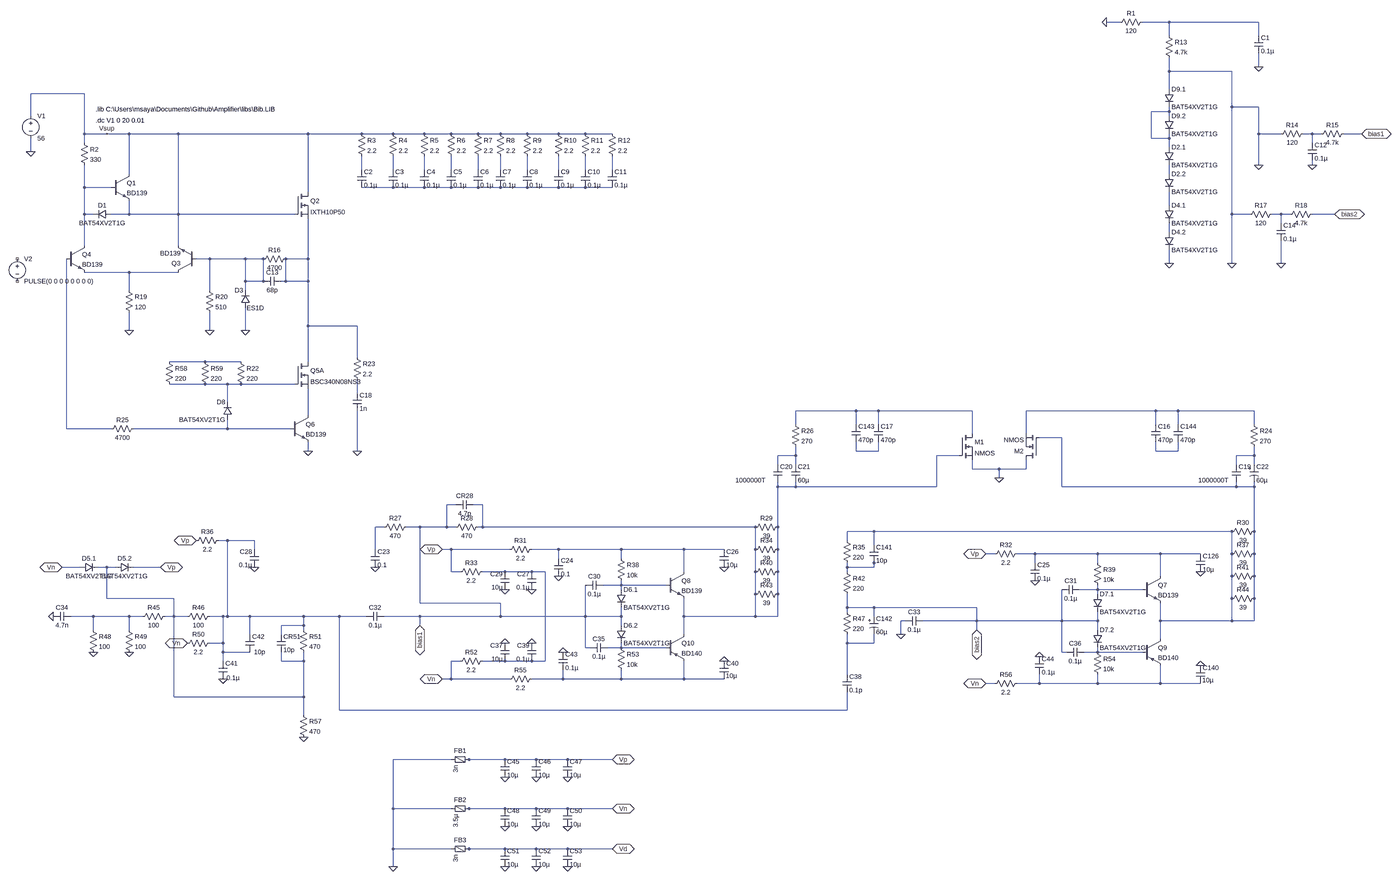
[diagram p0: schematic pulse Amplifier.asc, whole sheet]
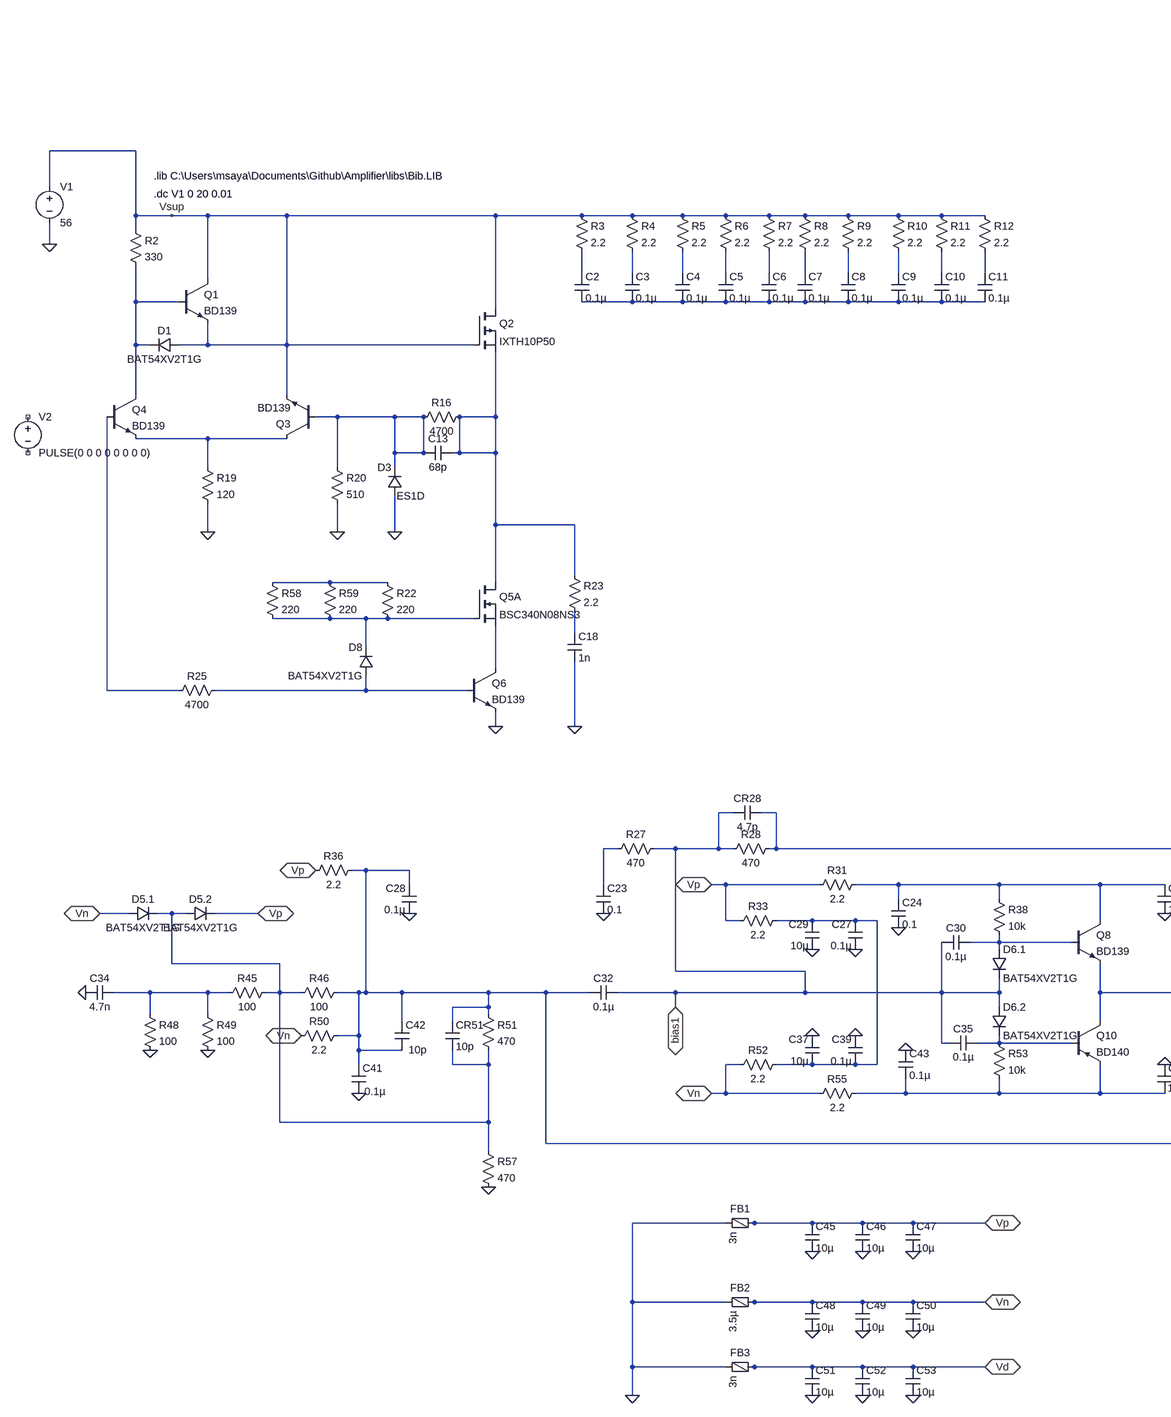
[diagram p1: schematic pulse Amplifier.asc, part, row 1 of 1, column 1 of 2]
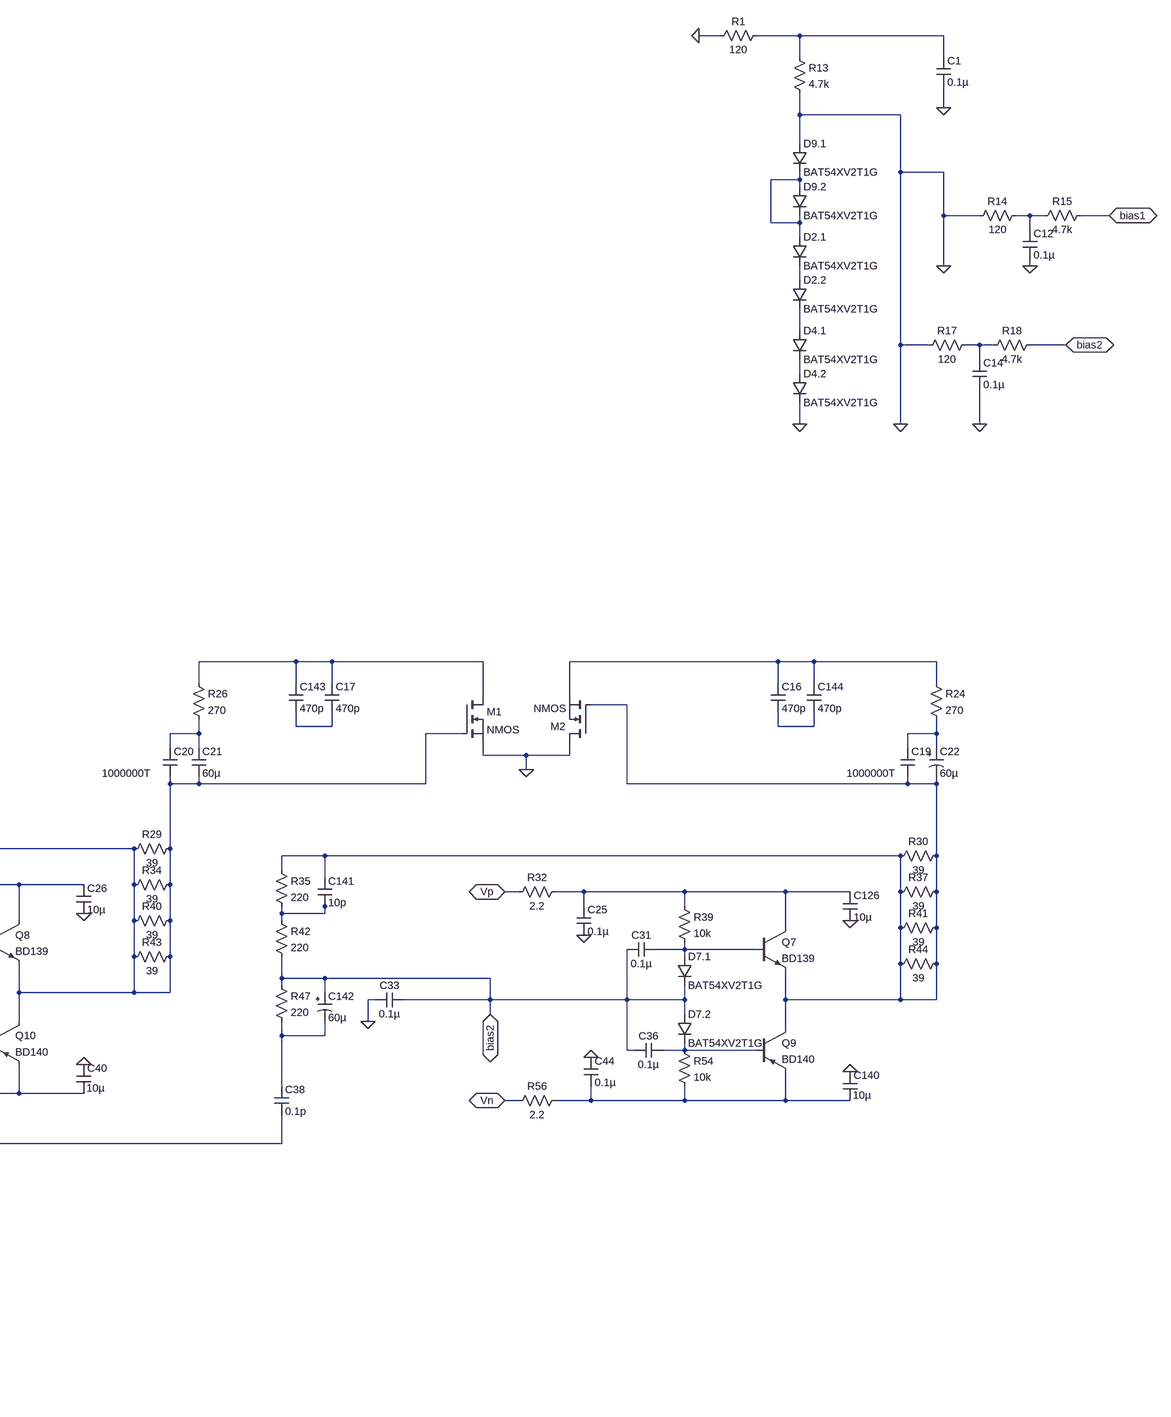
[diagram p2: schematic pulse Amplifier.asc, part, row 1 of 1, column 2 of 2]
pulse Amplifier.asc, the LTspice schematic file:
Version 4
SHEET 1 4920 2452
WIRE 3936 -672 3888 -672
WIRE 4112 -672 4016 -672
WIRE 4432 -672 4112 -672
WIRE 4112 -624 4112 -672
WIRE 4432 -624 4432 -672
WIRE 4432 -512 4432 -560
WIRE 4112 -496 4112 -544
WIRE 4336 -496 4112 -496
WIRE 4112 -432 4112 -496
WIRE 192 -416 0 -416
WIRE 4336 -368 4336 -496
WIRE 4432 -368 4336 -368
WIRE 4112 -352 4112 -368
WIRE 4112 -352 4048 -352
WIRE 0 -336 0 -416
WIRE 4112 -336 4112 -352
WIRE 192 -272 192 -416
WIRE 272 -272 192 -272
WIRE 352 -272 272 -272
WIRE 528 -272 352 -272
WIRE 992 -272 528 -272
WIRE 1184 -272 992 -272
WIRE 1296 -272 1184 -272
WIRE 1408 -272 1296 -272
WIRE 1504 -272 1408 -272
WIRE 1600 -272 1504 -272
WIRE 1680 -272 1600 -272
WIRE 1776 -272 1680 -272
WIRE 1888 -272 1776 -272
WIRE 1984 -272 1888 -272
WIRE 2080 -272 1984 -272
WIRE 4432 -272 4432 -368
WIRE 4512 -272 4432 -272
WIRE 4624 -272 4592 -272
WIRE 4656 -272 4624 -272
WIRE 4800 -272 4736 -272
WIRE 4048 -256 4048 -352
WIRE 4112 -256 4112 -272
WIRE 4112 -256 4048 -256
WIRE 192 -240 192 -272
WIRE 4624 -240 4624 -272
WIRE 4112 -224 4112 -256
WIRE 0 -208 0 -256
WIRE 4432 -160 4432 -272
WIRE 4624 -160 4624 -176
WIRE 1184 -144 1184 -192
WIRE 1296 -144 1296 -192
WIRE 1408 -144 1408 -192
WIRE 1504 -144 1504 -192
WIRE 1600 -144 1600 -192
WIRE 1680 -144 1680 -192
WIRE 1776 -144 1776 -192
WIRE 1888 -144 1888 -192
WIRE 1984 -144 1984 -192
WIRE 2080 -144 2080 -192
WIRE 352 -128 352 -272
WIRE 4112 -128 4112 -160
WIRE 192 -80 192 -160
WIRE 288 -80 192 -80
WIRE 1296 -80 1184 -80
WIRE 1408 -80 1296 -80
WIRE 1504 -80 1408 -80
WIRE 1600 -80 1504 -80
WIRE 1680 -80 1600 -80
WIRE 1776 -80 1680 -80
WIRE 1888 -80 1776 -80
WIRE 1984 -80 1888 -80
WIRE 2080 -80 1984 -80
WIRE 992 -64 992 -272
WIRE 4112 -16 4112 -64
WIRE 192 16 192 -80
WIRE 224 16 192 16
WIRE 352 16 352 -32
WIRE 352 16 288 16
WIRE 528 16 528 -272
WIRE 528 16 352 16
WIRE 944 16 528 16
WIRE 4336 16 4336 -368
WIRE 4400 16 4336 16
WIRE 4512 16 4480 16
WIRE 4544 16 4512 16
WIRE 4704 16 4624 16
WIRE 4512 48 4512 16
WIRE 4112 80 4112 48
WIRE 192 128 192 16
WIRE 528 128 528 16
WIRE 640 176 592 176
WIRE 768 176 640 176
WIRE 832 176 768 176
WIRE 992 176 992 32
WIRE 992 176 912 176
WIRE 4112 192 4112 144
WIRE 4336 192 4336 16
WIRE 4512 192 4512 112
WIRE 352 224 192 224
WIRE 528 224 352 224
WIRE 768 256 768 176
WIRE 832 256 832 176
WIRE 832 256 768 256
WIRE 912 256 912 176
WIRE 912 256 896 256
WIRE 992 256 992 176
WIRE 992 256 912 256
WIRE 352 288 352 224
WIRE 640 288 640 176
WIRE 768 288 768 256
WIRE 992 416 992 256
WIRE 1168 416 992 416
WIRE 352 432 352 368
WIRE 640 432 640 368
WIRE 768 432 768 352
WIRE 1168 528 1168 416
WIRE 624 544 496 544
WIRE 752 544 624 544
WIRE 992 544 992 416
WIRE 624 624 496 624
WIRE 704 624 624 624
WIRE 752 624 704 624
WIRE 944 624 752 624
WIRE 1168 656 1168 608
WIRE 704 688 704 624
WIRE 2992 720 2736 720
WIRE 3072 720 2992 720
WIRE 3408 720 3072 720
WIRE 4064 720 3600 720
WIRE 4144 720 4064 720
WIRE 4416 720 4144 720
WIRE 992 736 992 640
WIRE 2736 768 2736 720
WIRE 2992 768 2992 720
WIRE 3072 768 3072 720
WIRE 4064 768 4064 720
WIRE 4144 768 4144 720
WIRE 4416 768 4416 720
WIRE 128 784 128 176
WIRE 288 784 128 784
WIRE 704 784 704 752
WIRE 704 784 368 784
WIRE 928 784 704 784
WIRE 3408 800 3408 720
WIRE 3600 800 3600 720
WIRE 3728 816 3648 816
WIRE 992 864 992 832
WIRE 1168 864 1168 720
WIRE 2992 864 2992 832
WIRE 3072 864 3072 832
WIRE 3072 864 2992 864
WIRE 4064 864 4064 832
WIRE 4144 864 4144 832
WIRE 4144 864 4064 864
WIRE 2736 880 2736 848
WIRE 2736 880 2672 880
WIRE 3360 880 3280 880
WIRE 4416 880 4416 848
WIRE 4416 880 4352 880
WIRE 2672 912 2672 880
WIRE 2736 912 2736 880
WIRE 4352 912 4352 880
WIRE 4416 912 4416 880
WIRE 3408 928 3408 896
WIRE 3504 928 3408 928
WIRE 3600 928 3600 896
WIRE 3600 928 3504 928
WIRE 3504 960 3504 928
WIRE 2672 992 2672 976
WIRE 2736 992 2736 976
WIRE 2736 992 2672 992
WIRE 3280 992 3280 880
WIRE 3280 992 2736 992
WIRE 3728 992 3728 816
WIRE 4352 992 4352 976
WIRE 4352 992 3728 992
WIRE 4416 992 4416 976
WIRE 4416 992 4352 992
WIRE 1520 1056 1488 1056
WIRE 1616 1056 1584 1056
WIRE 1264 1136 1232 1136
WIRE 1392 1136 1344 1136
WIRE 1488 1136 1488 1056
WIRE 1488 1136 1392 1136
WIRE 1520 1136 1488 1136
WIRE 1616 1136 1616 1056
WIRE 1616 1136 1600 1136
WIRE 2592 1136 1616 1136
WIRE 2672 1136 2672 992
WIRE 3056 1152 2960 1152
WIRE 4336 1152 3056 1152
WIRE 4416 1152 4416 992
WIRE 704 1184 672 1184
WIRE 800 1184 704 1184
WIRE 2960 1184 2960 1152
WIRE 3056 1200 3056 1152
WIRE 800 1216 800 1184
WIRE 1232 1216 1232 1136
WIRE 1504 1216 1472 1216
WIRE 1712 1216 1504 1216
WIRE 1888 1216 1792 1216
WIRE 2112 1216 1888 1216
WIRE 2336 1216 2112 1216
WIRE 2480 1216 2336 1216
WIRE 2592 1216 2592 1136
WIRE 2672 1216 2672 1136
WIRE 3488 1232 3456 1232
WIRE 3632 1232 3568 1232
WIRE 3856 1232 3632 1232
WIRE 4080 1232 3856 1232
WIRE 4224 1232 4080 1232
WIRE 4336 1232 4336 1152
WIRE 4416 1232 4416 1152
WIRE 1888 1248 1888 1216
WIRE 2112 1248 2112 1216
WIRE 3056 1264 3056 1248
WIRE 3632 1264 3632 1232
WIRE 3856 1264 3856 1232
WIRE 176 1280 112 1280
WIRE 272 1280 240 1280
WIRE 304 1280 272 1280
WIRE 464 1280 368 1280
WIRE 2960 1280 2960 1264
WIRE 3056 1280 3056 1264
WIRE 3056 1280 2960 1280
WIRE 1504 1296 1504 1216
WIRE 1536 1296 1504 1296
WIRE 1696 1296 1616 1296
WIRE 1792 1296 1696 1296
WIRE 1840 1296 1792 1296
WIRE 2336 1296 2336 1216
WIRE 2592 1296 2592 1216
WIRE 2672 1296 2672 1216
WIRE 2960 1296 2960 1280
WIRE 4080 1312 4080 1232
WIRE 4336 1312 4336 1232
WIRE 4416 1312 4416 1232
WIRE 2112 1344 2112 1328
WIRE 2112 1344 2048 1344
WIRE 2272 1344 2112 1344
WIRE 2112 1360 2112 1344
WIRE 3856 1360 3856 1344
WIRE 3856 1360 3792 1360
WIRE 4016 1360 3856 1360
WIRE 2592 1376 2592 1296
WIRE 2672 1376 2672 1296
WIRE 3856 1376 3856 1360
WIRE 272 1392 272 1280
WIRE 512 1392 272 1392
WIRE 4336 1392 4336 1312
WIRE 4416 1392 4416 1312
WIRE 1392 1408 1392 1136
WIRE 1680 1408 1392 1408
WIRE 2960 1424 2960 1376
WIRE 3056 1424 2960 1424
WIRE 3424 1424 3056 1424
WIRE 2960 1440 2960 1424
WIRE 224 1456 144 1456
WIRE 352 1456 224 1456
WIRE 400 1456 352 1456
WIRE 512 1456 512 1392
WIRE 512 1456 480 1456
WIRE 560 1456 512 1456
WIRE 688 1456 640 1456
WIRE 704 1456 704 1184
WIRE 704 1456 688 1456
WIRE 784 1456 704 1456
WIRE 976 1456 784 1456
WIRE 1104 1456 976 1456
WIRE 1200 1456 1104 1456
WIRE 1392 1456 1264 1456
WIRE 1680 1456 1680 1408
WIRE 1680 1456 1392 1456
WIRE 1984 1456 1984 1344
WIRE 1984 1456 1680 1456
WIRE 2112 1456 2112 1424
WIRE 2112 1456 1984 1456
WIRE 2336 1456 2336 1392
WIRE 2592 1456 2592 1376
WIRE 2592 1456 2336 1456
WIRE 2672 1456 2672 1376
WIRE 2672 1456 2592 1456
WIRE 3056 1456 3056 1424
WIRE 3168 1472 3152 1472
WIRE 3424 1472 3424 1424
WIRE 3424 1472 3232 1472
WIRE 3728 1472 3728 1360
WIRE 3728 1472 3424 1472
WIRE 3856 1472 3856 1440
WIRE 3856 1472 3728 1472
WIRE 4080 1472 4080 1408
WIRE 4336 1472 4336 1392
WIRE 4336 1472 4080 1472
WIRE 4416 1472 4416 1392
WIRE 4416 1472 4336 1472
WIRE 976 1488 976 1456
WIRE 976 1488 896 1488
WIRE 1392 1488 1392 1456
WIRE 2112 1488 2112 1456
WIRE 224 1504 224 1456
WIRE 352 1504 352 1456
WIRE 976 1504 976 1488
WIRE 3424 1504 3424 1472
WIRE 3856 1504 3856 1472
WIRE 784 1520 784 1456
WIRE 896 1520 896 1488
WIRE 2336 1520 2336 1456
WIRE 3152 1520 3152 1472
WIRE 4080 1536 4080 1472
WIRE 688 1552 688 1456
WIRE 688 1552 640 1552
WIRE 2960 1552 2960 1520
WIRE 3056 1552 3056 1520
WIRE 3056 1552 2960 1552
WIRE 1984 1568 1984 1456
WIRE 2000 1568 1984 1568
WIRE 2112 1568 2112 1552
WIRE 2112 1568 2064 1568
WIRE 2272 1568 2112 1568
WIRE 688 1584 688 1552
WIRE 784 1584 688 1584
WIRE 3728 1584 3728 1472
WIRE 3744 1584 3728 1584
WIRE 3856 1584 3856 1568
WIRE 3856 1584 3808 1584
WIRE 4016 1584 3856 1584
WIRE 688 1616 688 1584
WIRE 896 1616 896 1584
WIRE 976 1616 976 1584
WIRE 976 1616 896 1616
WIRE 1536 1616 1504 1616
WIRE 1696 1616 1616 1616
WIRE 1792 1616 1696 1616
WIRE 1840 1616 1840 1296
WIRE 1840 1616 1792 1616
WIRE 2960 1664 2960 1552
WIRE 1504 1680 1504 1616
WIRE 1504 1680 1472 1680
WIRE 1712 1680 1504 1680
WIRE 1904 1680 1904 1648
WIRE 1904 1680 1792 1680
WIRE 2112 1680 2112 1648
WIRE 2112 1680 1904 1680
WIRE 2336 1680 2336 1616
WIRE 2336 1680 2112 1680
WIRE 2480 1680 2336 1680
WIRE 3488 1696 3456 1696
WIRE 3648 1696 3648 1664
WIRE 3648 1696 3568 1696
WIRE 3856 1696 3856 1664
WIRE 3856 1696 3648 1696
WIRE 4080 1696 4080 1632
WIRE 4080 1696 3856 1696
WIRE 4224 1696 4080 1696
WIRE 512 1744 512 1456
WIRE 976 1744 976 1616
WIRE 976 1744 512 1744
WIRE 1104 1792 1104 1456
WIRE 2960 1792 2960 1728
WIRE 2960 1792 1104 1792
WIRE 976 1808 976 1744
WIRE 1504 1968 1296 1968
WIRE 1568 1968 1552 1968
WIRE 1696 1968 1568 1968
WIRE 1808 1968 1696 1968
WIRE 1920 1968 1808 1968
WIRE 2080 1968 1920 1968
WIRE 1296 2144 1296 1968
WIRE 1504 2144 1296 2144
WIRE 1568 2144 1552 2144
WIRE 1696 2144 1568 2144
WIRE 1808 2144 1696 2144
WIRE 1920 2144 1808 2144
WIRE 2080 2144 1920 2144
WIRE 1296 2288 1296 2144
WIRE 1504 2288 1296 2288
WIRE 1568 2288 1552 2288
WIRE 1696 2288 1568 2288
WIRE 1808 2288 1696 2288
WIRE 1920 2288 1808 2288
WIRE 2080 2288 1920 2288
WIRE 1296 2352 1296 2288
FLAG 768 432 0
FLAG 640 432 0
FLAG 352 432 0
FLAG 0 -208 0
FLAG 1168 864 0
FLAG 992 864 0
FLAG 272 -272 Vsup
FLAG 80 1456 0
FLAG 800 1280 0
FLAG 688 1680 0
FLAG 224 1584 0
FLAG 352 1584 0
FLAG 976 1888 0
FLAG 1232 1280 0
FLAG 1888 1312 0
FLAG 1904 1584 0
FLAG 2480 1280 0
FLAG 2480 1616 0
FLAG 4224 1296 0
FLAG 4224 1632 0
FLAG 3648 1600 0
FLAG 3632 1328 0
FLAG 3152 1520 0
FLAG 3504 960 0
FLAG 4624 -160 0
FLAG 4432 -160 0
FLAG 4512 192 0
FLAG 4336 192 0
FLAG 4112 192 0
FLAG 4432 -512 0
FLAG 3888 -672 0
FLAG 1696 1360 0
FLAG 1696 1552 0
FLAG 1792 1360 0
FLAG 1792 1552 0
FLAG 4800 -272 bias1
IOPIN 4800 -272 BiDir
FLAG 4704 16 bias2
IOPIN 4704 16 BiDir
FLAG 1920 2032 0
FLAG 1808 2032 0
FLAG 1696 2032 0
FLAG 1696 2208 0
FLAG 1808 2208 0
FLAG 1920 2208 0
FLAG 1920 2352 0
FLAG 1808 2352 0
FLAG 1696 2352 0
FLAG 1296 2352 0
FLAG 2080 1968 Vp
IOPIN 2080 1968 BiDir
FLAG 2080 2144 Vn
IOPIN 2080 2144 BiDir
FLAG 2080 2288 Vd
IOPIN 2080 2288 BiDir
FLAG 464 1280 Vp
IOPIN 464 1280 BiDir
FLAG 592 1184 Vp
IOPIN 592 1184 BiDir
FLAG 112 1280 Vn
IOPIN 112 1280 BiDir
FLAG 560 1552 Vn
IOPIN 560 1552 BiDir
FLAG 1472 1680 Vn
IOPIN 1472 1680 BiDir
FLAG 1472 1216 Vp
IOPIN 1472 1216 BiDir
FLAG 1392 1488 bias1
IOPIN 1392 1488 BiDir
FLAG 3456 1232 Vp
IOPIN 3456 1232 BiDir
FLAG 3456 1696 Vn
IOPIN 3456 1696 BiDir
FLAG 3424 1504 bias2
IOPIN 3424 1504 BiDir
SYMBOL voltage 0 -352 R0
WINDOW 123 0 0 Left 0
WINDOW 39 0 0 Left 0
SYMATTR InstName V1
SYMATTR Value 56
SYMBOL res 176 -256 R0
SYMATTR InstName R2
SYMATTR Value 330
SYMATTR SpiceLine pwr=0.5
SYMBOL pmos 944 -64 R0
SYMATTR InstName Q2
SYMATTR Value IXTH10P50
SYMBOL nmos 944 544 R0
SYMATTR InstName Q5A
SYMATTR Value BSC340N08NS3
SYMBOL res 1168 -288 R0
SYMATTR InstName R3
SYMATTR Value 2.2
SYMBOL res 1280 -288 R0
SYMATTR InstName R4
SYMATTR Value 2.2
SYMBOL res 1392 -288 R0
SYMATTR InstName R5
SYMATTR Value 2.2
SYMBOL res 1488 -288 R0
SYMATTR InstName R6
SYMATTR Value 2.2
SYMBOL res 1584 -288 R0
SYMATTR InstName R7
SYMATTR Value 2.2
SYMBOL res 1664 -288 R0
SYMATTR InstName R8
SYMATTR Value 2.2
SYMBOL res 1760 -288 R0
SYMATTR InstName R9
SYMATTR Value 2.2
SYMBOL res 1872 -288 R0
SYMATTR InstName R10
SYMATTR Value 2.2
SYMBOL res 1968 -288 R0
SYMATTR InstName R11
SYMATTR Value 2.2
SYMBOL res 2064 -288 R0
SYMATTR InstName R12
SYMATTR Value 2.2
SYMBOL cap 1168 -144 R0
SYMATTR InstName C2
SYMATTR Value 0.1µ
SYMBOL cap 1280 -144 R0
SYMATTR InstName C3
SYMATTR Value 0.1µ
SYMBOL cap 1392 -144 R0
SYMATTR InstName C4
SYMATTR Value 0.1µ
SYMBOL cap 1488 -144 R0
SYMATTR InstName C5
SYMATTR Value 0.1µ
SYMBOL cap 1584 -144 R0
SYMATTR InstName C6
SYMATTR Value 0.1µ
SYMBOL cap 1664 -144 R0
SYMATTR InstName C7
SYMATTR Value 0.1µ
SYMBOL cap 1760 -144 R0
SYMATTR InstName C8
SYMATTR Value 0.1µ
SYMBOL cap 1872 -144 R0
SYMATTR InstName C9
SYMATTR Value 0.1µ
SYMBOL cap 1968 -144 R0
SYMATTR InstName C10
SYMATTR Value 0.1µ
SYMBOL cap 2064 -144 R0
SYMATTR InstName C11
SYMATTR Value 0.1µ
SYMBOL res 928 160 R90
WINDOW 0 0 56 VBottom 2
WINDOW 3 32 56 VTop 2
SYMATTR InstName R16
SYMATTR Value 4700
SYMATTR SpiceLine pwr=1
SYMBOL cap 896 240 R90
WINDOW 0 0 32 VBottom 2
WINDOW 3 32 32 VTop 2
SYMATTR InstName C13
SYMATTR Value 68p
SYMBOL diode 784 352 R180
WINDOW 0 24 64 Left 2
WINDOW 3 -50 0 Left 2
SYMATTR InstName D3
SYMATTR Value ES1D
SYMBOL diode 720 752 R180
WINDOW 0 24 64 Left 2
WINDOW 3 24 0 Left 2
SYMATTR InstName D8
SYMATTR Value BAT54XV2T1G
SYMBOL res 480 528 R0
SYMATTR InstName R58
SYMATTR Value 220
SYMATTR SpiceLine pwr=0.5
SYMBOL res 608 528 R0
SYMATTR InstName R59
SYMATTR Value 220
SYMATTR SpiceLine pwr=0.5
SYMBOL res 736 528 R0
SYMATTR InstName R22
SYMATTR Value 220
SYMATTR SpiceLine pwr=0.5
SYMBOL res 384 768 R90
WINDOW 0 0 56 VBottom 2
WINDOW 3 32 56 VTop 2
SYMATTR InstName R25
SYMATTR Value 4700
SYMBOL res 336 272 R0
SYMATTR InstName R19
SYMATTR Value 120
SYMBOL res 1152 512 R0
SYMATTR InstName R23
SYMATTR Value 2.2
SYMBOL res 624 272 R0
SYMATTR InstName R20
SYMATTR Value 510
SYMATTR SpiceLine pwr=0.5
SYMBOL cap 1152 656 R0
SYMATTR InstName C18
SYMATTR Value 1n
SYMBOL npn 288 -128 R0
SYMATTR InstName Q1
SYMATTR Value BD139
SYMBOL npn 128 128 R0
SYMATTR InstName Q4
SYMATTR Value BD139
SYMBOL npn 592 224 R180
SYMATTR InstName Q3
SYMATTR Value BD139
SYMBOL npn 928 736 R0
SYMATTR InstName Q6
SYMATTR Value BD139
SYMBOL diode 288 0 R90
WINDOW 0 0 32 VBottom 2
WINDOW 3 32 32 VTop 2
SYMATTR InstName D1
SYMATTR Value BAT54XV2T1G
SYMBOL cap 144 1440 R90
WINDOW 0 0 32 VBottom 2
WINDOW 3 32 32 VTop 2
SYMATTR InstName C34
SYMATTR Value 4.7n
SYMBOL cap 816 1280 R180
WINDOW 0 24 56 Left 2
WINDOW 3 24 8 Left 2
SYMATTR InstName C28
SYMATTR Value 0.1µ
SYMBOL cap 672 1616 R0
WINDOW 3 28 60 Left 2
SYMATTR Value 0.1µ
SYMATTR InstName C41
SYMBOL cap 768 1520 R0
WINDOW 3 31 63 Left 2
SYMATTR Value 10p
SYMATTR InstName C42
SYMBOL res 208 1488 R0
SYMATTR InstName R48
SYMATTR Value 100
SYMBOL res 496 1440 R90
WINDOW 0 0 56 VBottom 2
WINDOW 3 32 56 VTop 2
SYMATTR InstName R45
SYMATTR Value 100
SYMBOL res 336 1488 R0
SYMATTR InstName R49
SYMATTR Value 100
SYMBOL res 544 1472 R270
WINDOW 0 32 56 VTop 2
WINDOW 3 0 56 VBottom 2
SYMATTR InstName R46
SYMATTR Value 100
SYMBOL res 688 1168 R90
WINDOW 0 0 56 VBottom 2
WINDOW 3 32 56 VTop 2
SYMATTR InstName R36
SYMATTR Value 2.2
SYMBOL res 656 1536 R90
WINDOW 0 0 56 VBottom 2
WINDOW 3 32 56 VTop 2
SYMATTR InstName R50
SYMATTR Value 2.2
SYMBOL res 960 1792 R0
SYMATTR InstName R57
SYMATTR Value 470
SYMBOL res 960 1488 R0
SYMATTR InstName R51
SYMATTR Value 470
SYMBOL cap 880 1520 R0
SYMATTR InstName CR51
SYMATTR Value 10p
SYMBOL cap 1264 1440 R90
WINDOW 0 0 32 VBottom 2
WINDOW 3 32 32 VTop 2
SYMATTR InstName C32
SYMATTR Value 0.1µ
SYMBOL cap 1712 1360 R180
WINDOW 0 24 56 Left 2
WINDOW 3 24 8 Left 2
SYMATTR InstName C29
SYMATTR Value 10µ
SYMBOL cap 1808 1360 R180
WINDOW 0 24 56 Left 2
WINDOW 3 24 8 Left 2
SYMATTR InstName C27
SYMATTR Value 0.1µ
SYMBOL cap 1712 1616 R180
WINDOW 0 24 56 Left 2
WINDOW 3 24 8 Left 2
SYMATTR InstName C37
SYMATTR Value 10µ
SYMBOL cap 1808 1616 R180
WINDOW 0 24 56 Left 2
WINDOW 3 24 8 Left 2
SYMATTR InstName C39
SYMATTR Value 0.1µ
SYMBOL cap 1216 1216 R0
SYMATTR InstName C23
SYMATTR Value 0.1
SYMBOL res 1632 1600 R90
WINDOW 0 0 56 VBottom 2
WINDOW 3 32 56 VTop 2
SYMATTR InstName R52
SYMATTR Value 2.2
SYMBOL res 1808 1664 R90
WINDOW 0 0 56 VBottom 2
WINDOW 3 32 56 VTop 2
SYMATTR InstName R55
SYMATTR Value 2.2
SYMBOL res 1360 1120 R90
WINDOW 0 0 56 VBottom 2
WINDOW 3 32 56 VTop 2
SYMATTR InstName R27
SYMATTR Value 470
SYMBOL res 1808 1200 R90
WINDOW 0 0 56 VBottom 2
WINDOW 3 32 56 VTop 2
SYMATTR InstName R31
SYMATTR Value 2.2
SYMBOL res 1616 1120 R90
WINDOW 0 0 56 VBottom 2
WINDOW 3 32 56 VTop 2
SYMATTR InstName R28
SYMATTR Value 470
SYMBOL res 1632 1280 R90
WINDOW 0 0 56 VBottom 2
WINDOW 3 32 56 VTop 2
SYMATTR InstName R33
SYMATTR Value 2.2
SYMBOL cap 1584 1040 R90
WINDOW 0 0 32 VBottom 2
WINDOW 3 32 32 VTop 2
SYMATTR InstName CR28
SYMATTR Value 4.7p
SYMBOL cap 1872 1248 R0
SYMATTR InstName C24
SYMATTR Value 0.1
SYMBOL cap 1888 1584 R0
SYMATTR InstName C43
SYMATTR Value 0.1µ
SYMBOL cap 2464 1216 R0
SYMATTR InstName C26
SYMATTR Value 10µ
SYMBOL cap 2464 1616 R0
WINDOW 3 22 52 Left 2
SYMATTR Value 10µ
SYMATTR InstName C40
SYMBOL cap 2048 1328 R90
WINDOW 0 0 32 VBottom 2
WINDOW 3 32 32 VTop 2
SYMATTR InstName C30
SYMATTR Value 0.1µ
SYMBOL cap 2064 1552 R90
WINDOW 0 0 32 VBottom 2
WINDOW 3 32 32 VTop 2
SYMATTR InstName C35
SYMATTR Value 0.1µ
SYMBOL diode 2096 1360 R0
SYMATTR InstName D6.1
SYMATTR Value BAT54XV2T1G
SYMBOL diode 2096 1488 R0
SYMATTR InstName D6.2
SYMATTR Value BAT54XV2T1G
SYMBOL res 2096 1552 R0
SYMATTR InstName R53
SYMATTR Value 10k
SYMBOL res 2096 1232 R0
SYMATTR InstName R38
SYMATTR Value 10k
SYMBOL npn 2272 1296 R0
SYMATTR InstName Q8
SYMATTR Value BD139
SYMBOL pnp 2272 1520 R0
SYMATTR InstName Q10
SYMATTR Value BD140
SYMBOL res 2688 1120 R90
WINDOW 0 0 56 VBottom 2
WINDOW 3 32 56 VTop 2
SYMATTR InstName R29
SYMATTR Value 39
SYMBOL res 2688 1200 R90
WINDOW 0 0 56 VBottom 2
WINDOW 3 32 56 VTop 2
SYMATTR InstName R34
SYMATTR Value 39
SYMBOL res 2688 1280 R90
WINDOW 0 0 56 VBottom 2
WINDOW 3 32 56 VTop 2
SYMATTR InstName R40
SYMATTR Value 39
SYMBOL res 2688 1360 R90
WINDOW 0 0 56 VBottom 2
WINDOW 3 32 56 VTop 2
SYMATTR InstName R43
SYMATTR Value 39
SYMBOL cap 3232 1456 R90
WINDOW 0 0 32 VBottom 2
WINDOW 3 32 32 VTop 2
SYMATTR InstName C33
SYMATTR Value 0.1µ
SYMBOL cap 3040 1200 R0
SYMATTR InstName C141
SYMATTR Value 10p
SYMBOL res 3584 1680 R90
WINDOW 0 0 56 VBottom 2
WINDOW 3 32 56 VTop 2
SYMATTR InstName R56
SYMATTR Value 2.2
SYMBOL res 3584 1216 R90
WINDOW 0 0 56 VBottom 2
WINDOW 3 32 56 VTop 2
SYMATTR InstName R32
SYMATTR Value 2.2
SYMBOL cap 3616 1264 R0
SYMATTR InstName C25
SYMATTR Value 0.1µ
SYMBOL cap 3632 1600 R0
SYMATTR InstName C44
SYMATTR Value 0.1µ
SYMBOL cap 4208 1232 R0
SYMATTR InstName C126
SYMATTR Value 10µ
SYMBOL cap 4208 1632 R0
WINDOW 3 22 52 Left 2
SYMATTR Value 10µ
SYMATTR InstName C140
SYMBOL cap 3792 1344 R90
WINDOW 0 0 32 VBottom 2
WINDOW 3 32 32 VTop 2
SYMATTR InstName C31
SYMATTR Value 0.1µ
SYMBOL cap 3808 1568 R90
WINDOW 0 0 32 VBottom 2
WINDOW 3 32 32 VTop 2
SYMATTR InstName C36
SYMATTR Value 0.1µ
SYMBOL diode 3840 1376 R0
SYMATTR InstName D7.1
SYMATTR Value BAT54XV2T1G
SYMBOL diode 3840 1504 R0
SYMATTR InstName D7.2
SYMATTR Value BAT54XV2T1G
SYMBOL res 3840 1568 R0
SYMATTR InstName R54
SYMATTR Value 10k
SYMBOL res 3840 1248 R0
SYMATTR InstName R39
SYMATTR Value 10k
SYMBOL npn 4016 1312 R0
SYMATTR InstName Q7
SYMATTR Value BD139
SYMBOL pnp 4016 1536 R0
SYMATTR InstName Q9
SYMATTR Value BD140
SYMBOL res 4432 1136 R90
WINDOW 0 0 56 VBottom 2
WINDOW 3 32 56 VTop 2
SYMATTR InstName R30
SYMATTR Value 39
SYMBOL res 4432 1216 R90
WINDOW 0 0 56 VBottom 2
WINDOW 3 32 56 VTop 2
SYMATTR InstName R37
SYMATTR Value 39
SYMBOL res 4432 1296 R90
WINDOW 0 0 56 VBottom 2
WINDOW 3 32 56 VTop 2
SYMATTR InstName R41
SYMATTR Value 39
SYMBOL res 4432 1376 R90
WINDOW 0 0 56 VBottom 2
WINDOW 3 32 56 VTop 2
SYMATTR InstName R44
SYMATTR Value 39
SYMBOL res 2944 1168 R0
SYMATTR InstName R35
SYMATTR Value 220
SYMBOL res 2944 1280 R0
SYMATTR InstName R42
SYMATTR Value 220
SYMBOL res 2944 1424 R0
SYMATTR InstName R47
SYMATTR Value 220
SYMBOL polcap 3040 1456 R0
WINDOW 3 24 56 Left 2
SYMATTR Value 60µ
SYMATTR InstName C142
SYMATTR Description Capacitor
SYMATTR Type cap
SYMATTR SpiceLine V=600 Irms=18.5 Rser=0.0115 Lser=13.4n mfg="Würth Elektronik" pn="890764429002CS WCAP-FTDB 52.5x57x43.5x29.5x4" type="Box"
SYMBOL cap 2944 1664 R0
SYMATTR InstName C38
SYMATTR Value 0.1p
SYMBOL cap 2656 912 R0
WINDOW 3 -136 56 Left 2
SYMATTR Value 1000000T
SYMATTR InstName C20
SYMBOL cap 2720 912 R0
SYMATTR InstName C21
SYMATTR Value 60µ
SYMATTR SpiceLine V=600 Irms=18.5 Rser=0.0115 Lser=13.4n mfg="Würth Elektronik" pn="890764429002CS WCAP-FTDB 52.5x57x43.5x29.5x4" type="Box"
SYMBOL cap 2976 768 R0
SYMATTR InstName C143
SYMATTR Value 470p
SYMBOL cap 3056 768 R0
SYMATTR InstName C17
SYMATTR Value 470p
SYMBOL cap 4048 768 R0
SYMATTR InstName C16
SYMATTR Value 470p
SYMBOL cap 4128 768 R0
SYMATTR InstName C144
SYMATTR Value 470p
SYMBOL cap 4336 912 R0
WINDOW 3 -120 56 Left 2
SYMATTR Value 1000000T
SYMATTR InstName C19
SYMBOL polcap 4400 912 R0
WINDOW 3 24 56 Left 2
SYMATTR Value 60µ
SYMATTR InstName C22
SYMATTR Description Capacitor
SYMATTR Type cap
SYMATTR SpiceLine V=600 Irms=18.5 Rser=0.0115 Lser=13.4n mfg="Würth Elektronik" pn="890764429002CS WCAP-FTDB 52.5x57x43.5x29.5x4" type="Box"
SYMBOL res 2720 752 R0
SYMATTR InstName R26
SYMATTR Value 270
SYMBOL res 4400 752 R0
SYMATTR InstName R24
SYMATTR Value 270
SYMBOL nmos 3360 800 R0
SYMATTR InstName M1
SYMBOL nmos 3648 896 R180
SYMATTR InstName M2
SYMBOL diode 4096 -16 R0
SYMATTR InstName D4.1
SYMATTR Value BAT54XV2T1G
SYMBOL diode 4096 80 R0
SYMATTR InstName D4.2
SYMATTR Value BAT54XV2T1G
SYMBOL diode 4096 -224 R0
SYMATTR InstName D2.1
SYMATTR Value BAT54XV2T1G
SYMBOL diode 4096 -128 R0
SYMATTR InstName D2.2
SYMATTR Value BAT54XV2T1G
SYMBOL diode 4096 -432 R0
SYMATTR InstName D9.1
SYMATTR Value BAT54XV2T1G
SYMBOL diode 4096 -336 R0
SYMATTR InstName D9.2
SYMATTR Value BAT54XV2T1G
SYMBOL res 4096 -640 R0
SYMATTR InstName R13
SYMATTR Value 4.7k
SYMBOL res 4032 -688 R90
WINDOW 0 0 56 VBottom 2
WINDOW 3 32 56 VTop 2
SYMATTR InstName R1
SYMATTR Value 120
SYMBOL res 4608 -288 R90
WINDOW 0 0 56 VBottom 2
WINDOW 3 32 56 VTop 2
SYMATTR InstName R14
SYMATTR Value 120
SYMBOL res 4752 -288 R90
WINDOW 0 0 56 VBottom 2
WINDOW 3 32 56 VTop 2
SYMATTR InstName R15
SYMATTR Value 4.7k
SYMBOL res 4496 0 R90
WINDOW 0 0 56 VBottom 2
WINDOW 3 32 56 VTop 2
SYMATTR InstName R17
SYMATTR Value 120
SYMBOL res 4640 0 R90
WINDOW 0 0 56 VBottom 2
WINDOW 3 32 56 VTop 2
SYMATTR InstName R18
SYMATTR Value 4.7k
SYMBOL cap 4608 -240 R0
SYMATTR InstName C12
SYMATTR Value 0.1µ
SYMBOL cap 4416 -624 R0
SYMATTR InstName C1
SYMATTR Value 0.1µ
SYMBOL cap 4496 48 R0
SYMATTR InstName C14
SYMATTR Value 0.1µ
SYMBOL diode 176 1296 R270
WINDOW 0 32 32 VTop 2
WINDOW 3 0 32 VBottom 2
SYMATTR InstName D5.1
SYMATTR Value BAT54XV2T1G
SYMBOL diode 304 1296 R270
WINDOW 0 32 32 VTop 2
WINDOW 3 0 32 VBottom 2
SYMATTR InstName D5.2
SYMATTR Value BAT54XV2T1G
SYMBOL cap 1904 1968 R0
SYMATTR InstName C47
SYMATTR Value 10µ
SYMBOL cap 1792 1968 R0
SYMATTR InstName C46
SYMATTR Value 10µ
SYMBOL cap 1680 1968 R0
SYMATTR InstName C45
SYMATTR Value 10µ
SYMBOL cap 1904 2144 R0
SYMATTR InstName C50
SYMATTR Value 10µ
SYMBOL cap 1792 2144 R0
SYMATTR InstName C49
SYMATTR Value 10µ
SYMBOL cap 1680 2144 R0
SYMATTR InstName C48
SYMATTR Value 10µ
SYMBOL cap 1904 2288 R0
SYMATTR InstName C53
SYMATTR Value 10µ
SYMBOL cap 1792 2288 R0
SYMATTR InstName C52
SYMATTR Value 10µ
SYMBOL cap 1680 2288 R0
SYMATTR InstName C51
SYMATTR Value 10µ
SYMBOL FerriteBead 1536 1968 R90
WINDOW 0 -16 0 VBottom 2
SYMATTR InstName FB1
SYMATTR Value 3n
SYMATTR SpiceLine Ipk=2 Rser=0.064 Rpar=620 Cpar=1.1p mfg="Würth Elektronik" pn="782763621 WE-CBA 1206"
SYMBOL FerriteBead 1536 2144 R90
WINDOW 0 -16 0 VBottom 2
SYMATTR InstName FB2
SYMATTR Value 3.5µ
SYMATTR SpiceLine Ipk=2.5 Rser=0.06 Rpar=626 Cpar=1.15p mfg="Würth Elektronik" pn="782763601 WE-CBA 1206"
SYMBOL FerriteBead 1536 2288 R90
WINDOW 0 -16 0 VBottom 2
SYMATTR InstName FB3
SYMATTR Value 3n
SYMATTR SpiceLine Ipk=2 Rser=0.064 Rpar=620 Cpar=1.1p mfg="Würth Elektronik" pn="782763621 WE-CBA 1206"
SYMBOL voltage -48 160 R0
WINDOW 123 0 0 Left 0
WINDOW 39 0 0 Left 0
SYMATTR InstName V2
SYMATTR Value PULSE(0 0 0 0 0 0 0 0)
TEXT 232 -320 Left 2 !.dc V1 0 20 0.01
TEXT 232 -360 Left 2 !.lib C:\\Users\\msaya\\Documents\\Github\\Amplifier\\libs\\Bib.LIB

The netlist it stands for:
* pulse Amplifier.asc
V1 Vsup 0 56
R2 Vsup N015 330 pwr=0.5
M§Q2 Vsup Vsup N021 N021 IXTH10P50
M§Q5A N021 N024 N028 N028 BSC340N08NS3
R3 Vsup N004 2.2
R4 Vsup N005 2.2
R5 Vsup N006 2.2
R6 Vsup N007 2.2
R7 Vsup N008 2.2
R8 Vsup N009 2.2
R9 Vsup N010 2.2
R10 Vsup N011 2.2
R11 Vsup N012 2.2
R12 Vsup N013 2.2
C2 N004 N016 0.1µ
C3 N005 N016 0.1µ
C4 N006 N016 0.1µ
C5 N007 N016 0.1µ
C6 N008 N016 0.1µ
C7 N009 N016 0.1µ
C8 N010 N016 0.1µ
C9 N011 N016 0.1µ
C10 N012 N016 0.1µ
C11 N013 N016 0.1µ
R16 N021 N020 4700 pwr=1
C13 N021 N020 68p
D3 0 N020 ES1D
D8 N030 N024 BAT54XV2T1G
R58 N023 N024 220 pwr=0.5
R59 N023 N024 220 pwr=0.5
R22 N023 N024 220 pwr=0.5
R25 N030 N029 4700
R19 N022 0 120
R23 N021 N025 2.2
R20 N020 0 510 pwr=0.5
C18 N025 0 1n
Q1 Vsup N015 Vsup 0 BD139
Q4 N015 N029 N022 0 BD139
Q3 N022 N020 Vsup 0 BD139
Q6 N028 N030 0 0 BD139
D1 Vsup N015 BAT54XV2T1G
C34 N046 0 4.7n
C28 0 N038 0.1µ
C41 N038 0 0.1µ
C42 N038 N038 10p
R48 N046 0 100
R45 N042 N046 100
R49 N046 0 100
R46 N042 N038 100
R36 N038 Vp 2.2
R50 N038 Vn 2.2
R57 N042 0 470
R51 N038 N042 470
CR51 N038 N042 10p
C32 bias1 N038 0.1µ
C29 0 N043 10µ
C27 0 N043 0.1µ
C37 N043 0 10µ
C39 N043 0 0.1µ
C23 N037 0 0.1
R52 N043 Vn 2.2
R55 N050 Vn 2.2
R27 bias1 N037 470
R31 N039 Vp 2.2
R28 N035 bias1 470
R33 N043 Vp 2.2
CR28 N035 bias1 4.7p
C24 N039 0 0.1
C43 0 N050 0.1µ
C26 N039 0 10µ
C40 0 N050 10µ
C30 N044 bias1 0.1µ
C35 N048 bias1 0.1µ
D6.1 N044 bias1 BAT54XV2T1G
D6.2 bias1 N048 BAT54XV2T1G
R53 N048 N050 10k
R38 N039 N044 10k
Q8 N039 N044 N035 0 BD139
Q10 N035 N048 N050 0 BD140
R29 N035 N035 39
R34 N035 N035 39
R40 N035 N035 39
R43 N035 N035 39
C33 bias2 0 0.1µ
C141 N031 N041 10p
R56 N051 Vn 2.2
R32 N040 Vp 2.2
C25 N040 0 0.1µ
C44 0 N051 0.1µ
C126 N040 0 10µ
C140 0 N051 10µ
C31 N045 bias2 0.1µ
C36 N049 bias2 0.1µ
D7.1 N045 bias2 BAT54XV2T1G
D7.2 bias2 N049 BAT54XV2T1G
R54 N049 N051 10k
R39 N040 N045 10k
Q7 N040 N045 N031 0 BD139
Q9 N031 N049 N051 0 BD140
R30 N031 N031 39
R37 N031 N031 39
R41 N031 N031 39
R44 N031 N031 39
R35 N031 N041 220
R42 N041 bias2 220
R47 bias2 N047 220
C142 bias2 N047 60µ V=600 Irms=18.5 Rser=0.0115 Lser=13.4n mfg="Würth Elektronik" pn="890764429002CS WCAP-FTDB 52.5x57x43.5x29.5x4" type="Box"
C38 N047 N038 0.1p
C20 N034 N035 1000000T
C21 N034 N035 60µ V=600 Irms=18.5 Rser=0.0115 Lser=13.4n mfg="Würth Elektronik" pn="890764429002CS WCAP-FTDB 52.5x57x43.5x29.5x4" type="Box"
C143 N026 N032 470p
C17 N026 N032 470p
C16 N027 N033 470p
C144 N027 N033 470p
C19 N036 N031 1000000T
C22 N036 N031 60µ V=600 Irms=18.5 Rser=0.0115 Lser=13.4n mfg="Würth Elektronik" pn="890764429002CS WCAP-FTDB 52.5x57x43.5x29.5x4" type="Box"
R26 N026 N034 270
R24 N027 N036 270
M1 N026 N035 0 0 NMOS
M2 0 N031 N027 N027 NMOS
D4.1 N017 N019 BAT54XV2T1G
D4.2 N019 0 BAT54XV2T1G
D2.1 N002 N014 BAT54XV2T1G
D2.2 N014 N017 BAT54XV2T1G
D9.1 0 N002 BAT54XV2T1G
D9.2 N002 N002 BAT54XV2T1G
R13 N001 0 4.7k
R1 N001 0 120
R14 N003 0 120
R15 bias1 N003 4.7k
R17 N018 0 120
R18 bias2 N018 4.7k
C12 N003 0 0.1µ
C1 N001 0 0.1µ
C14 N018 0 0.1µ
D5.1 Vn N042 BAT54XV2T1G
D5.2 N042 Vp BAT54XV2T1G
C47 Vp 0 10µ
C46 Vp 0 10µ
C45 Vp 0 10µ
C50 Vn 0 10µ
C49 Vn 0 10µ
C48 Vn 0 10µ
C53 Vd 0 10µ
C52 Vd 0 10µ
C51 Vd 0 10µ
L§FB1 Vp 0 3n Ipk=2 Rser=0.064 Rpar=620 Cpar=1.1p mfg="Würth Elektronik" pn="782763621 WE-CBA 1206"
L§FB2 Vn 0 3.5µ Ipk=2.5 Rser=0.06 Rpar=626 Cpar=1.15p mfg="Würth Elektronik" pn="782763601 WE-CBA 1206"
L§FB3 Vd 0 3n Ipk=2 Rser=0.064 Rpar=620 Cpar=1.1p mfg="Würth Elektronik" pn="782763621 WE-CBA 1206"
V2 NC_01 NC_02 PULSE(0 0 0 0 0 0 0 0)
.model D D
.lib standard.dio
.model NPN NPN
.model PNP PNP
.lib standard.bjt
.model NMOS NMOS
.model PMOS PMOS
.lib standard.mos
.dc V1 0 20 0.01
.lib C:\Users\msaya\Documents\Github\Amplifier\libs\Bib.LIB
.backanno
.end